# Altium schematic sheet outgoing connection.SchDoc
size A4
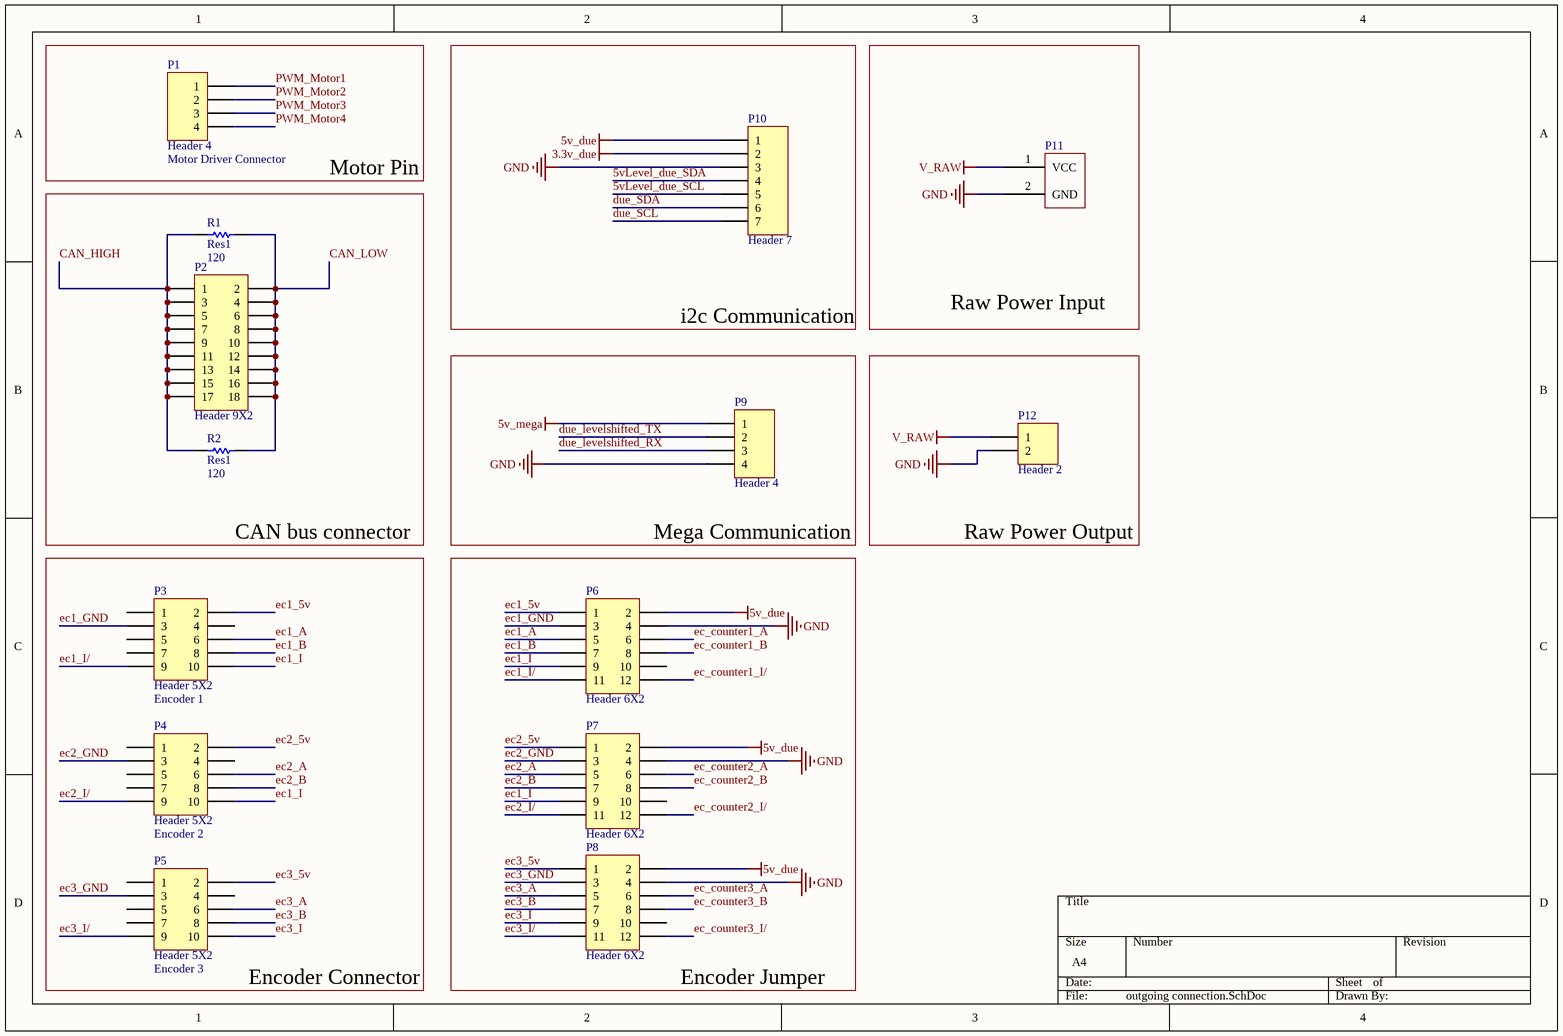
[diagram p0: outgoing connection.SchDoc]

## Parts
P1  Header 4  Usage: Motor Driver Connector  [HDR1X4]
P2  Header 9X2  [HDR2X9]
P3  Header 5X2  Usage: Encoder 1  [HDR2X5]
P4  Header 5X2  Usage: Encoder 2  [HDR2X5]
P5  Header 5X2  Usage: Encoder 3  [HDR2X5]
P6  Header 6X2  [HDR2X6]
P7  Header 6X2  [HDR2X6]
P8  Header 6X2  [HDR2X6]
P9  Header 4  [HDR1X4]
P10  Header 7  [HDR1X7]
P11  big Pin power port  [bigPin_power_port]  (value not drawn)
P12  Header 2  [HDR1X2]
R1  Res1  value 120  [AXIAL-0.3]
R2  Res1  value 120  [AXIAL-0.3]

## Nets
3.3v_due: P10.2
5v_due: P6.2 P7.2 P8.2 P10.1
5v_mega: P9.1
GND: P6.4 P7.4 P8.4 P9.4 P10.3 P11.2(GND) P12.2
V_RAW: P11.1(VCC) P12.1
5vLevel_due_SCL: P10.5
5vLevel_due_SDA: P10.4
CAN_HIGH: P2.1 P2.3 P2.5 P2.7 P2.9 P2.11 P2.13 P2.15 P2.17 R1.1 R2.1
CAN_LOW: P2.2 P2.4 P2.6 P2.8 P2.10 P2.12 P2.14 P2.16 P2.18 R1.2 R2.2
due_levelshifted_RX: P9.3
due_levelshifted_TX: P9.2
due_SCL: P10.7
due_SDA: P10.6
ec1_5v: P3.2 P6.1
ec1_A: P3.6 P6.5
ec1_B: P3.8 P6.7
ec1_GND: P3.3 P6.3
ec1_I: P3.10 P4.10 P6.9 P7.9
ec1_I/: P3.9 P6.11
ec2_5v: P4.2 P7.1
ec2_A: P4.6 P7.5
ec2_B: P4.8 P7.7
ec2_GND: P4.3 P7.3
ec2_I/: P4.9 P7.11
ec3_5v: P5.2 P8.1
ec3_A: P5.6 P8.5
ec3_B: P5.8 P8.7
ec3_GND: P5.3 P8.3
ec3_I: P5.10 P8.9
ec3_I/: P5.9 P8.11
ec_counter1_A: P6.6
ec_counter1_B: P6.8
ec_counter1_I/: P6.12
ec_counter2_A: P7.6
ec_counter2_B: P7.8
ec_counter2_I/: P7.12
ec_counter3_A: P8.6
ec_counter3_B: P8.8
ec_counter3_I/: P8.12
PWM_Motor1: P1.1
PWM_Motor2: P1.2
PWM_Motor3: P1.3
PWM_Motor4: P1.4

Not connected (* = marked no-connect by the designer): P3 1 4 5 7; P4 1 4 5 7; P5 1 4 5 7; P6 10; P7 10; P8 10

## Notes on the sheet
- Motor Pin
- Raw Power Input
- i2c Communication
- CAN bus connector
- Mega Communication
- Raw Power Output
- (near P5) Encoder Connector
- (near P8) Encoder Jumper

## Library data of the parts
P1 P9 = Header 4: Header, 4-Pin; LatestRevisionDate: 17-Jul-2002; LatestRevisionNote: Re-released for DXP Platform.; Publisher: Altium Limited
P2 = Header 9X2: Header, 9-Pin, Dual row; LatestRevisionDate: 17-Jul-2002; LatestRevisionNote: Re-released for DXP Platform.; Publisher: Altium Limited
P3-P5 = Header 5X2: Header, 5-Pin, Dual row; LatestRevisionDate: 17-Jul-2002; LatestRevisionNote: Re-released for DXP Platform.; Publisher: Altium Limited
P6-P8 = Header 6X2: Header, 6-Pin, Dual row; LatestRevisionDate: 17-Jul-2002; LatestRevisionNote: Re-released for DXP Platform.; Publisher: Altium Limited
P10 = Header 7: Header, 7-Pin; LatestRevisionDate: 17-Jul-2002; LatestRevisionNote: Re-released for DXP Platform.; Publisher: Altium Limited
P12 = Header 2: Header, 2-Pin; LatestRevisionDate: 17-Jul-2002; LatestRevisionNote: Re-released for DXP Platform.; Publisher: Altium Limited
R1 R2 = Res1: Resistor; Published: 8-Jun-2000; LatestRevisionDate: 17-Jul-2002; LatestRevisionNote: Re-released for DXP Platform.; PackageReference: AXIAL-0.3; Publisher: Altium Limited; PackageDescription: Axial Device, Thru-Hole; 2 Leads; 0.3 in Pin Spacing